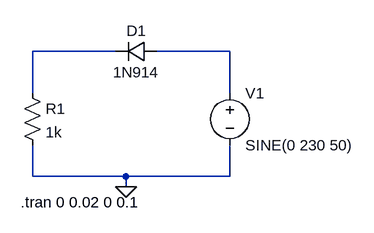
[diagram p0: schematic halfwave rectifier without filter.asc]
halfwave rectifier without filter.asc, the LTspice schematic file:
Version 4
SHEET 1 880 680
WIRE 144 64 16 64
WIRE 320 64 208 64
WIRE 16 128 16 64
WIRE 320 128 320 64
WIRE 16 256 16 208
WIRE 160 256 16 256
WIRE 320 256 320 208
WIRE 320 256 160 256
WIRE 160 272 160 256
FLAG 160 272 0
SYMBOL diode 208 48 R90
WINDOW 0 0 32 VBottom 2
WINDOW 3 32 32 VTop 2
SYMATTR InstName D1
SYMATTR Value 1N914
SYMBOL voltage 320 112 R0
WINDOW 123 0 0 Left 0
WINDOW 39 0 0 Left 0
SYMATTR InstName V1
SYMATTR Value SINE(0 230 50)
SYMBOL res 0 112 R0
SYMATTR InstName R1
SYMATTR Value 1k
TEXT -2 296 Left 2 !.tran 0 0.02 0 0.1

The netlist it stands for:
* halfwave rectifier without filter.asc
D1 N002 N001 1N914
V1 N002 0 SINE(0 230 50)
R1 N001 0 1k
.model D D
.lib standard.dio
.tran 0 0.02 0 0.1
.backanno
.end